# Altium schematic sheet 520mΩ 0402 Ferrite Beads.schdoc
size 127 x 99 mm
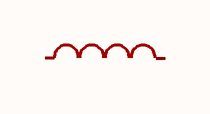
[diagram p0: 520mΩ 0402 Ferrite Beads.schdoc]

## Parts
L?  BLM15AG601SN1D  [L0402]  (value not drawn)

## Nets

Not connected (* = marked no-connect by the designer): L? 1 2

## Library data of the parts
L? = BLM15AG601SN1D: Manufacturer: muRata(村田); Add into BOM: yes; Impedance @ Frequency: 600Ω@100MHz; Tolerance: ±25%; DC Resistance: 520mΩ; Current Rating: 300mA; Circuits: 1; Symbol: BLM15AG601SN1D; Device: BLM15AG601SN1D; LCSC Part Name: 单路 0402磁珠 阻抗600Ω@100MHz; Supplier Part: C76884; Manufacturer Part: BLM15AG601SN1D; Supplier Footprint: 0402; JLCPCB Part Class: Extended Part; Datasheet: https://atta.szlcsc.com/upload/public/pdf/source/20181120/C333978_3E581FB55966932B05020139ABDE8E01.pdf; Supplier: LCSC; Convert to PCB: yes